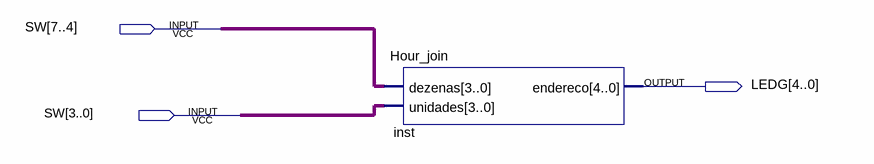
[diagram p0: schematic sheet]
// Quartus schematic Block1.bdf as structural Verilog: 1 symbols, 3 pins
module Block1 (
  input  [7:0] SW,
  output [4:0] LEDG
);

  Hour_join inst (.dezenas(SW[7:4]), .unidades(SW[3:0]), .endereco(LEDG));
endmodule
